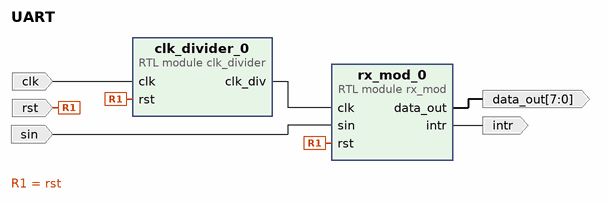
[diagram p0: block diagram of the top level]
# Vivado block design UART, xc7z020clg400-1, Vivado 2020.2
create_bd_design UART

create_bd_port -dir I -type clk clk
set_property -dict {CONFIG.CLK_DOMAIN UART2PWM_clk_0 CONFIG.FREQ_HZ 125000000} [get_bd_ports clk]
create_bd_port -dir I -type rst rst
create_bd_port -dir I sin
create_bd_port -dir O -from 7 -to 0 data_out
create_bd_port -dir O -type intr intr

create_bd_cell -type module -reference clk_divider clk_divider_0
create_bd_cell -type module -reference rx_mod rx_mod_0

# ---- connections ----

connect_bd_net [get_bd_pins clk_divider_0/clk_div] [get_bd_pins rx_mod_0/clk]
connect_bd_net [get_bd_ports clk] [get_bd_pins clk_divider_0/clk]
connect_bd_net [get_bd_ports rst] [get_bd_pins clk_divider_0/rst] [get_bd_pins rx_mod_0/rst]
connect_bd_net [get_bd_ports sin] [get_bd_pins rx_mod_0/sin]
connect_bd_net [get_bd_pins rx_mod_0/data_out] [get_bd_ports data_out]
connect_bd_net [get_bd_pins rx_mod_0/intr] [get_bd_ports intr]

validate_bd_design
save_bd_design
